# Altium schematic sheet Sheet1.SchDoc
size A3
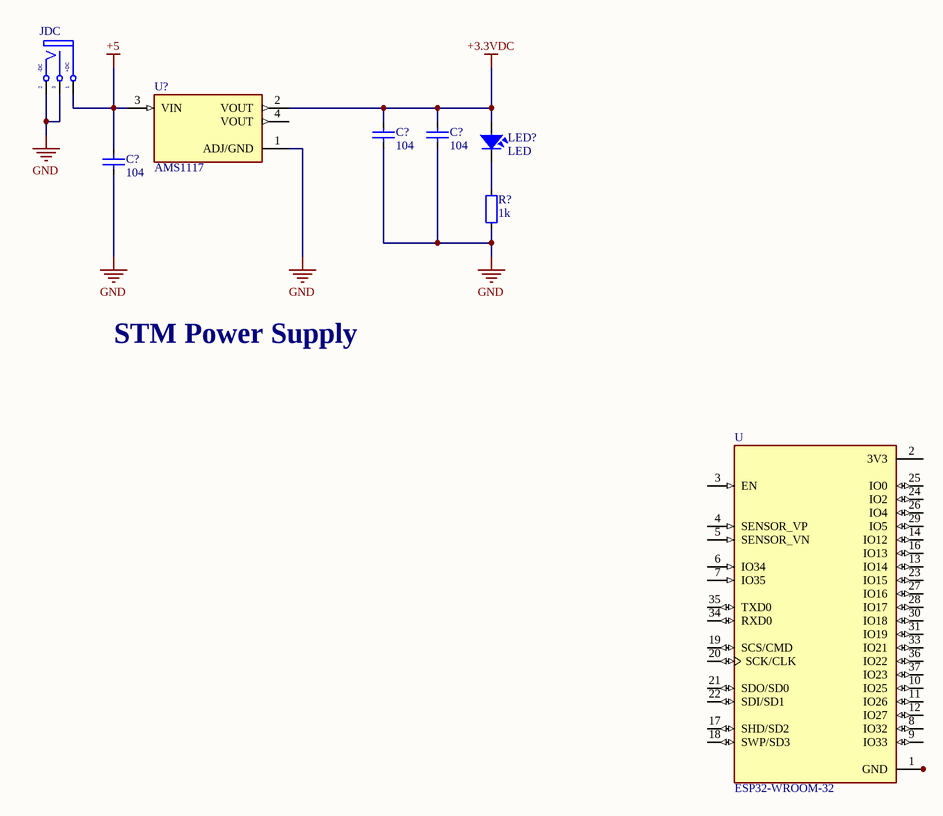
[diagram p0: Sheet1.SchDoc]

## Parts
(Parts that share a designator on the sheet are numbered #1, #2 ... from top to bottom, then left to right.)
C?#1  104  [CAP_0805]
C?#2  104  [CAP_0805]
C?#3  104  [CAP_0805]
JDC  Jac DC  [DC-IN]  (value not drawn)
LED?  LED  [LED-0805-Red]
R?  1k  [RES-SMD-0805]
U  ESP32-WROOM-32  [MODULE_ESP32-WROOM-32]
U?  AMS1117  [SOT229P700X180-4N]

## Nets
+3.3VDC: C?#1.2 C?#2.2 LED?.1 U?.2(VOUT)
+5: C?#3.2 JDC.1(T) U?.3(VIN)
GND: C?#1.1 C?#2.1 C?#3.1 JDC.2(TN) JDC.3(S) R?.1 U?.1(ADJ/GND)
NetLED?_2: LED?.2 R?.2
NetU_1: U.1(GND) U.15(GND) U.38(GND) U.39_1(GND) U.39_2(GND) U.39_3(GND) U.39_4(GND) U.39_5(GND) U.39_6(GND) U.39_7(GND) U.39_8(GND) U.39_9(GND) U.39_10(GND) U.39_11(GND) U.39_12(GND) U.39_13(GND) U.39_14(GND) U.39_15(GND) U.39_16(GND) U.39_17(GND) U.39_18(GND) U.39_19(GND) U.39_20(GND) U.39_21(GND)

Not connected (* = marked no-connect by the designer): U 2(3V3) 3(EN) 4(SENSOR_VP) 5(SENSOR_VN) 6(IO34) 7(IO35) 8(IO32) 9(IO33) 10(IO25) 11(IO26) 12(IO27) 13(IO14) 14(IO12) 16(IO13) 17(SHD/SD2) 18(SWP/SD3) 19(SCS/CMD) 20(SCK/CLK) 21(SDO/SD0) 22(SDI/SD1) 23(IO15) 24(IO2) 25(IO0) 26(IO4) 27(IO16) 28(IO17) 29(IO5) 30(IO18) 31(IO19) 33(IO21) 34(RXD0) 35(TXD0) 36(IO22) 37(IO23); U? 4(VOUT)

## Notes on the sheet
- STM Power Supply
- (in symbol DCIN) -DC; +DC

## Library data of the parts
C?#1-C?#3 = CapSMD: Capacitor; Value: 33p; Published: 8-Jun-2000; LatestRevisionDate: 17-Jul-2002; LatestRevisionNote: Re-released for DXP Platform.; PackageReference: RAD-0.3; Publisher: Altium Limited
JDC = DCIN: Jac DC input; Value: Jac DC
LED? = LED: LED Single colour Green and Red; Value: LED 3 ly Single Colour
R? = Resistor - SMD: Resistor; Manufacturer: Generic Components; Class: Passive; Published: 08/06/2000; Publisher: Altium Hobart Technology Centre
U = ESP32-WROOM-32: Bluetooth, WiFi Transceiver Module 2.4GHz ~ 2.5GHz Surface Mount; MF: Espressif Systems; Package: Module Espressif Systems; Digi-Key_Part_Number: 1904-1010-1-ND; Digi-Key_Purchase_URL: https://www.digikey.com/product-detail/en/espressif-systems/ESP32-WROOM-32/1904-1010-1-ND/8544305?utm_source=snapeda&utm_medium=aggregator&utm_campaign=symbol; Value: *; MP: ESP32-WROOM-32; SnapEDA_Link: https://www.snapeda.com/parts/ESP32-WROOM-32/Espressif%20Systems/view-part/2753322/?ref=snap
U? = AMS1117: 1A LOW DROPOUT VOLTAGE REGULATOR SOT-223; MF: Advanced Monolithic Systems; Price: None; Availability: Not in stock; Package: SOT-223 Seeed Technology; MP: AMS1117; Value: *; SnapEDA_Link: https://www.snapeda.com/parts/AMS1117/Advanced+Monolithic+Systems/view-part/?ref=snap; Check_prices: https://www.snapeda.com/parts/AMS1117/Advanced+Monolithic+Systems/view-part/?ref=eda